# Altium schematic sheet External WatchDogs.SchDoc: ExternalWatchDogs
size A4; Date: 18/06/2014; DrawnBy: J. Gabriel R.E.; Organization: Seven Solutions S.L.; Address1: C/Baza, Parcela 19, Nave 3; Address2: Polнgono Ind. Juncaril; Address3: 18210-Peligros-Granada; Address4: Spain; Revision: 3.4; SheetNumber: 10; SheetTotal: 23; WebAddress: www.sevensols.com; Project: White Rabbit; ProjectName: White Rabbit
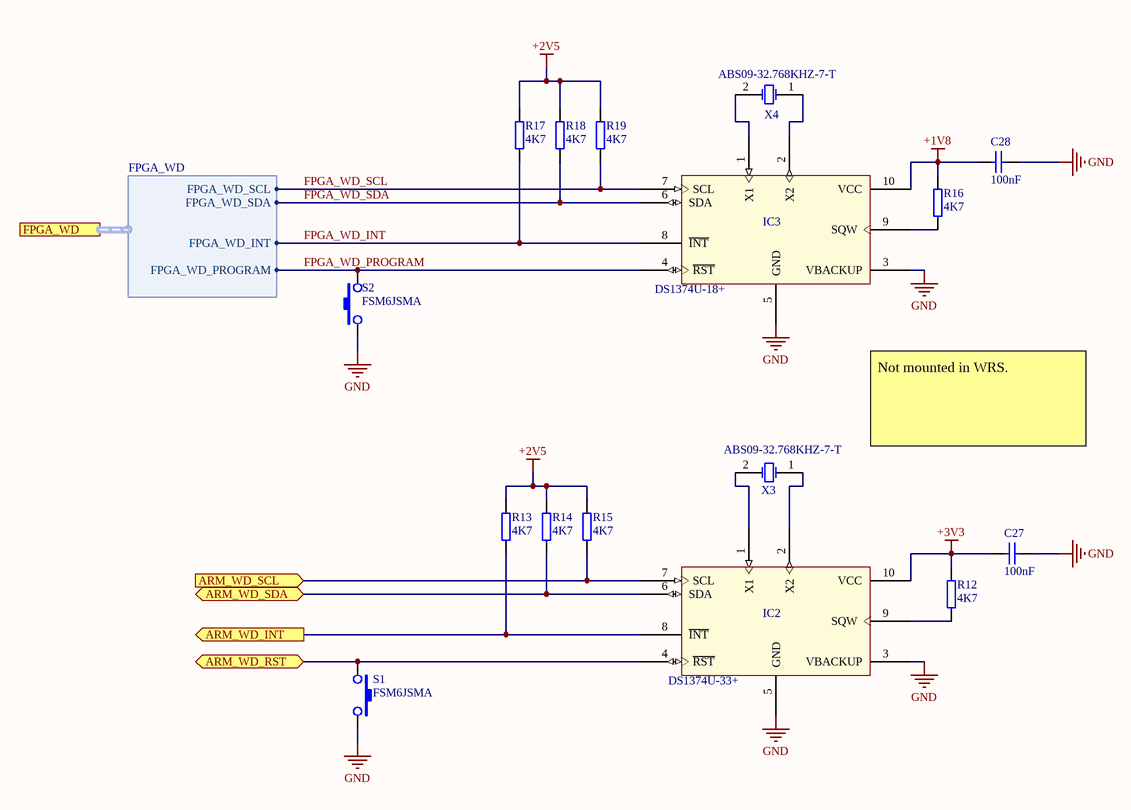
[diagram p0: External WatchDogs.SchDoc]

## Parts
C27  100nF  [CC1005-0402]
C28  100nF  [CC1005-0402]
IC2  DS1374U-33+  [UMAX10]
IC3  DS1374U-18+  [UMAX10]
R12  4K7  [0402]
R13  4K7  [0402]
R14  4K7  [0402]
R15  4K7  [0402]
R16  4K7  [0402]
R17  4K7  [0402]
R18  4K7  [0402]
R19  4K7  [0402]
S1  FSM6JSMA  [SWITCH-FSM6JSMA]
S2  FSM6JSMA  [SWITCH-FSM6JSMA]
X3  ABS09-32.768KHZ-7-T  [XTAL_abs09]
X4  ABS09-32.768KHZ-7-T  [XTAL_abs09]

## Ports
ARM_WD_INT (out), ARM_WD_RST (bidir), ARM_WD_SCL (in), ARM_WD_SDA (bidir), FPGA_WD (harness FPGA_WD)

## Harnesses
FPGA_WD: FPGA_WD_SCL, FPGA_WD_SDA, FPGA_WD_INT, FPGA_WD_PROGRAM

## Nets
+1V8: C28.2 IC3.10(VCC) R16.2
+2V5: R13.2 R14.2 R15.2 R17.2 R18.2 R19.2
+3V3: C27.2 IC2.10(VCC) R12.2
GND: C27.1 C28.1 IC2.3(VBACKUP) IC2.5(GND) IC3.3(VBACKUP) IC3.5(GND) S1.2 S2.1
ARM_WD_INT: IC2.8(~{INT}) R13.1 ; port ARM_WD_INT
ARM_WD_RST: IC2.4(~{RST}) S1.1 ; port ARM_WD_RST
ARM_WD_SCL: IC2.7(SCL) R15.1 ; port ARM_WD_SCL
ARM_WD_SDA: IC2.6(SDA) R14.1 ; port ARM_WD_SDA
FPGA_WD_INT: IC3.8(~{INT}) R17.1 ; port FPGA_WD.FPGA_WD_INT
FPGA_WD_PROGRAM: IC3.4(~{RST}) S2.2 ; port FPGA_WD.FPGA_WD_PROGRAM
FPGA_WD_SCL: IC3.7(SCL) R19.1 ; port FPGA_WD.FPGA_WD_SCL
FPGA_WD_SDA: IC3.6(SDA) R18.1 ; port FPGA_WD.FPGA_WD_SDA
NetIC2_1: IC2.1(X1) X3.2(OSC2)
NetIC2_2: IC2.2(X2) X3.1(OSC1)
NetIC2_9: IC2.9(SQW) R12.1
NetIC3_1: IC3.1(X1) X4.2(OSC2)
NetIC3_2: IC3.2(X2) X4.1(OSC1)
NetIC3_9: IC3.9(SQW) R16.1

## Notes on the sheet
- Not mounted in WRS.
- Title:
- Size:
- Revision:
- A4
- Drawn by:
- Date:
- Sheet
- of
- Project:

## Library data of the parts
C27 C28 = CC0402_100NF_16V_10%_X7R: Capacitor; Manufacturer1: TDK; Manufacturer1 PN: C1005X7R1C104K; TC: X7R; Tolerance: ±10%; Voltage: 16V; Mounted: No; Published: 8-Jun-2000; LatestRevisionDate: 17-Jul-2002; LatestRevisionNote: Re-released for DXP Platform.; PackageReference: RAD-0.3; Publisher: Altium Limited; Distributor1: Digikey; Distributor1 PN: 445-4952-1-ND; Case: 0402; Value: 100nF
IC2 = DS1374U-33+: I2C, 32 BIT BINARY COUNTER WATCHDOG RTC; Mounted: No; Value: DS1374U-33+; Distributor1 PN: DS1374U-33+-ND; Distributor1: Digikey
IC3 = DS1374U-18+: I2C, 32 BIT BINARY COUNTER WATCHDOG RTC; Mounted: No; Value: DS1374U-18+; Distributor1 PN: DS1374U-18+-ND; Distributor1: Digikey
R12-R19 = R0402_4.7K_±1%_0.1W_100PPM: SMD Resistor; Manufacturer1: Panasonic; Manufacturer1 PN: ERJ-2RKF4701X; TCR: 100ppm; Power Rating: 0.1W; Tolerance: ±1%; Mounted: No; Case: 0402; Distributor1: DigiKey; Distributor1 PN: ERJ-2RKF4701X; Value: 4K7
S1 S2 = SW-PB: Push button; Manufacturer: Tyco Electronics; Value: FSM6JSMA; Distributor1 PN: 1555991; Distributor1: Farnell
X3 X4 = XTAL: Crystal Oscillator 7pF; Manufacturer: Raltron; Mounted: No; Published: 8-Jun-2000; LatestRevisionDate: 17-Jul-2002; LatestRevisionNote: Re-released for DXP Platform.; PackageReference: R38; Publisher: Altium Limited; Value: ABS09-32.768KHZ-7-T; Distributor1: Farnell; Distributor1 PN: 1633672